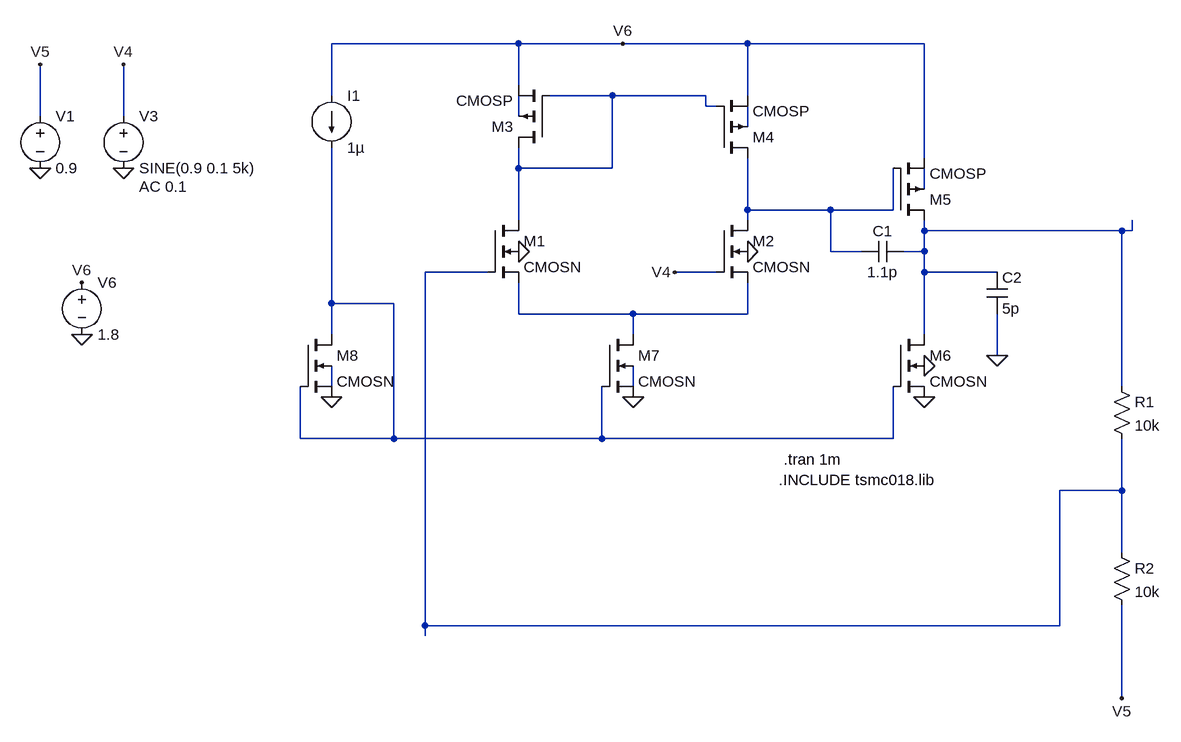
[diagram p0: schematic OTA_230108048_final.asc]
OTA_230108048_final.asc, the LTspice schematic file:
Version 4
SHEET 1 2004 912
WIRE 1008 -176 720 -176
WIRE 1168 -176 1008 -176
WIRE 1360 -176 1168 -176
WIRE 1632 -176 1360 -176
WIRE 1360 -128 1360 -176
WIRE 1008 -112 1008 -176
WIRE 720 -96 720 -176
WIRE 1152 -96 1056 -96
WIRE 1296 -96 1152 -96
WIRE 1360 -96 1360 -128
WIRE 1296 -80 1296 -96
WIRE 1312 -80 1296 -80
WIRE 272 -64 272 -144
WIRE 400 -64 400 -144
WIRE 1008 -64 1008 -96
WIRE 1632 -64 1632 -176
WIRE 1360 -48 1360 -80
WIRE 1632 0 1632 -64
WIRE 1008 16 1008 -16
WIRE 1152 16 1152 -96
WIRE 1152 16 1008 16
WIRE 1632 48 1632 16
WIRE 1360 80 1360 0
WIRE 1488 80 1360 80
WIRE 1584 80 1584 16
WIRE 1584 80 1488 80
WIRE 1008 96 1008 16
WIRE 1360 96 1360 80
WIRE 1632 112 1632 96
WIRE 1936 112 1632 112
WIRE 1952 112 1952 96
WIRE 1952 112 1936 112
WIRE 1488 144 1488 80
WIRE 1536 144 1488 144
WIRE 1632 144 1632 112
WIRE 1632 144 1600 144
WIRE 912 176 864 176
WIRE 960 176 912 176
WIRE 1264 176 1248 176
WIRE 1312 176 1264 176
WIRE 1632 176 1632 144
WIRE 1680 176 1632 176
WIRE 1744 176 1680 176
WIRE 720 224 720 -16
WIRE 784 224 720 224
WIRE 816 224 784 224
WIRE 1008 240 1008 192
WIRE 1184 240 1008 240
WIRE 1360 240 1360 192
WIRE 1360 240 1184 240
WIRE 720 272 720 224
WIRE 1184 272 1184 240
WIRE 1632 272 1632 176
WIRE 1744 304 1744 240
WIRE 720 352 720 320
WIRE 1184 352 1184 320
WIRE 1936 352 1936 112
WIRE 672 432 672 352
WIRE 816 432 816 224
WIRE 816 432 672 432
WIRE 1136 432 1136 352
WIRE 1136 432 816 432
WIRE 1584 432 1584 352
WIRE 1584 432 1136 432
WIRE 1936 512 1936 432
WIRE 1936 512 1840 512
WIRE 1936 608 1936 512
WIRE 864 720 864 176
WIRE 1840 720 1840 512
WIRE 1840 720 864 720
WIRE 864 736 864 720
WIRE 1936 832 1936 688
FLAG 400 16 0
FLAG 336 272 0
FLAG 400 -144 V4
FLAG 272 -144 V5
FLAG 1248 176 V4
FLAG 336 192 V6
FLAG 1168 -176 V6
FLAG 720 368 0
FLAG 1184 368 0
FLAG 1008 144 0
FLAG 1360 144 0
FLAG 1632 368 0
FLAG 1632 320 0
FLAG 272 16 0
FLAG 1744 304 0
FLAG 1936 832 V5
DATAFLAG 1008 16 ""
DATAFLAG 1184 240 ""
DATAFLAG 1360 80 ""
DATAFLAG 1360 -128 ""
DATAFLAG 912 176 ""
DATAFLAG 1264 176 ""
DATAFLAG 784 224 ""
DATAFLAG 1632 -64 ""
DATAFLAG 1488 80 ""
DATAFLAG 1680 176 ""
SYMBOL cmosn 960 96 R0
SYMATTR InstName M1
SYMATTR Value2 l=1u w=200u
SYMBOL cmosn 1312 96 R0
SYMATTR InstName M2
SYMATTR Value2 l=1u w=200u
SYMBOL voltage 400 -80 R0
WINDOW 123 24 124 Left 2
WINDOW 39 0 0 Left 2
SYMATTR Value2 AC 0.1
SYMATTR InstName V3
SYMATTR Value SINE(0.9 0.1 5k)
SYMBOL voltage 336 176 R0
WINDOW 123 0 0 Left 2
WINDOW 39 0 0 Left 2
SYMATTR InstName V6
SYMATTR Value 1.8
SYMBOL cmosp 1056 -16 R180
SYMATTR InstName M3
SYMATTR Value2 l=3u w=15u
SYMBOL cmosn 1136 272 R0
SYMATTR InstName M7
SYMATTR Value2 l=0.5u w=10u
SYMBOL cmosn 672 272 R0
SYMATTR InstName M8
SYMATTR Value2 l=2u w=4u
SYMBOL current 720 -96 R0
WINDOW 123 0 0 Left 2
WINDOW 39 0 0 Left 2
SYMATTR InstName I1
SYMATTR Value 1µ
SYMBOL cmosp 1312 0 M180
SYMATTR InstName M4
SYMATTR Value2 l=3u w=15u
SYMBOL cmosn 1584 272 R0
SYMATTR InstName M6
SYMATTR Value2 l=0.5u w=50u
SYMBOL cmosp 1584 96 M180
SYMATTR InstName M5
SYMATTR Value2 l=0.5u w=20u
SYMBOL cap 1600 128 R90
WINDOW 0 0 32 VBottom 2
WINDOW 3 32 32 VTop 2
SYMATTR InstName C1
SYMATTR Value 1.1p
SYMBOL cap 1728 176 R0
SYMATTR InstName C2
SYMATTR Value 5p
SYMBOL voltage 272 -80 R0
WINDOW 123 0 0 Left 2
WINDOW 39 0 0 Left 2
SYMATTR InstName V1
SYMATTR Value 0.9
SYMBOL res 1920 336 R0
SYMATTR InstName R1
SYMATTR Value 10k
SYMBOL res 1920 592 R0
SYMATTR InstName R2
SYMATTR Value 10k
TEXT 1408 496 Left 2 !.INCLUDE tsmc018.lib
TEXT 1416 464 Left 2 !.tran 1m

The netlist it stands for:
* OTA_230108048_final.asc
M1 N001 N007 N009 0 CMOSN l=1u w=200u
M2 N005 V4 N009 0 CMOSN l=1u w=200u
V3 V4 0 SINE(0.9 0.1 5k) AC 0.1
V6 V6 0 1.8
M3 N001 N001 V6 N002 CMOSP l=3u w=15u
M7 N009 N008 0 N011 CMOSN l=0.5u w=10u
M8 N008 N008 0 N010 CMOSN l=2u w=4u
I1 V6 N008 1µ
M4 N005 N001 V6 N003 CMOSP l=3u w=15u
M6 N006 N008 0 0 CMOSN l=0.5u w=50u
M5 N006 N005 V6 N004 CMOSP l=0.5u w=20u
C1 N006 N005 1.1p
C2 N006 0 5p
V1 V5 0 0.9
R1 N006 N007 10k
R2 N007 V5 10k
.model NMOS NMOS
.model PMOS PMOS
.lib standard.mos
.INCLUDE tsmc018.lib
.tran 1m
.backanno
.end